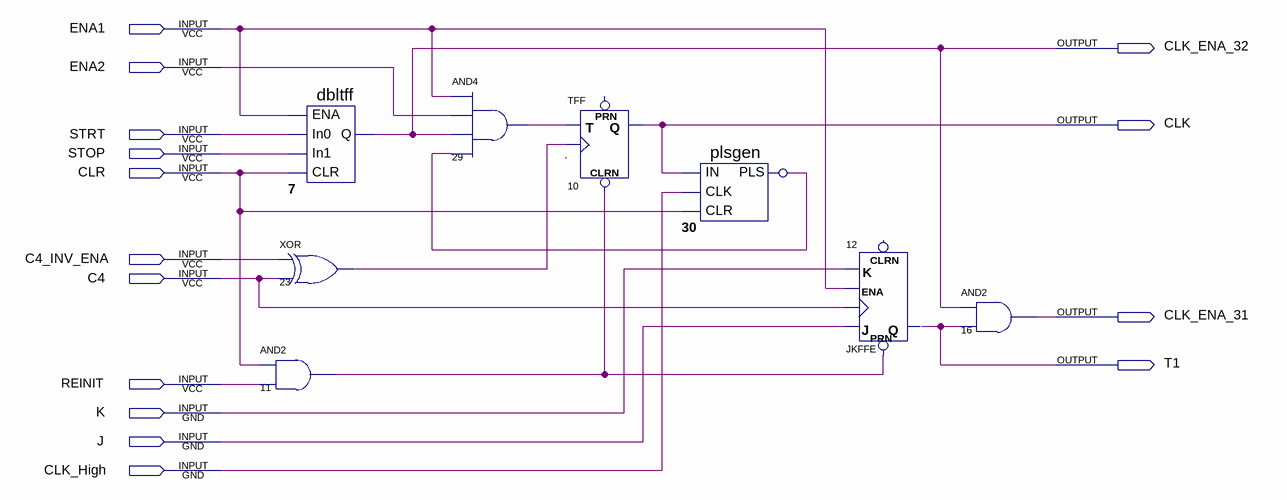
[diagram p0: schematic sheet]
// Quartus schematic ch_clk_ctrl.bdf as structural Verilog: 8 symbols, 15 pins
module ch_clk_ctrl (
  input  ENA1,
  input  ENA2,
  input  STRT,
  input  STOP,
  input  CLR,
  input  C4_INV_ENA,
  input  C4,
  input  REINIT,
  input  K,
  input  J,
  input  CLK_High,
  output CLK_ENA_32,
  output CLK,
  output CLK_ENA_31,
  output T1
);

  wire n11_out, n23_out, n29_out, n30_pls, n30_PLS_inverted_out;

  dbltff u_7 (.ENA(ENA1), .In0(STRT), .In1(STOP), .CLR(CLR), .Q(CLK_ENA_32));
  xor u_23 (n23_out, C4_INV_ENA, C4);
  and u_11 (n11_out, CLR, REINIT);
  and u_29 (n29_out, ENA1, ENA2, CLK_ENA_32, n30_PLS_inverted_out);
  TFF u_10 (.CLRN(n11_out), .T(n29_out), .CLK(n23_out), .Q(CLK));  // open: PRN
  plsgen u_30 (.IN(CLK), .CLK(CLK_High), .CLR(CLR), .PLS(n30_pls));
  not u_30_PLS_inverted (n30_PLS_inverted_out, n30_pls);
  JKFFE u_12 (.PRN(n11_out), .J(J), .CLK(C4), .K(K), .ENA(ENA1), .Q(T1));  // open: CLRN
  and u_16 (CLK_ENA_31, CLK_ENA_32, T1);
endmodule
